# EAGLE design DAB+ FM Radio (EAGLE 7.6.0)
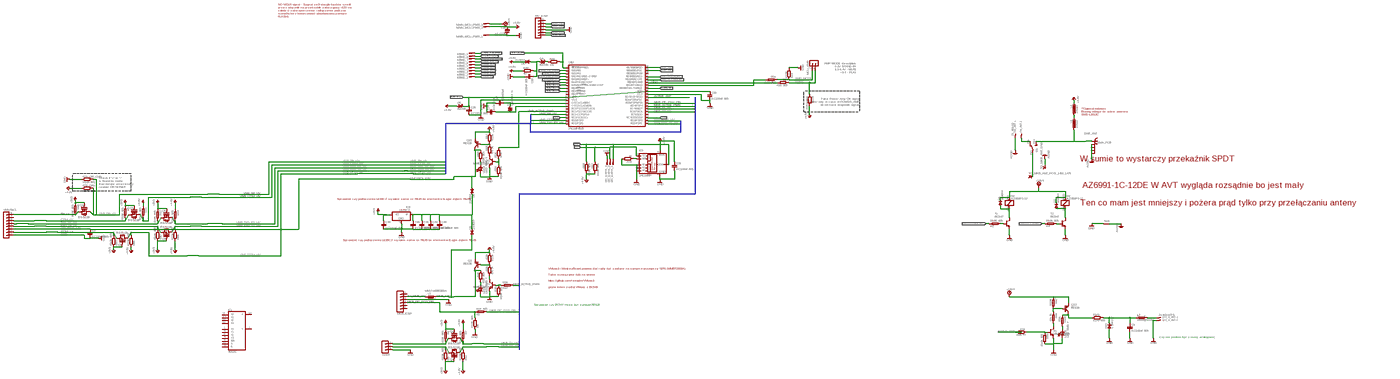
[diagram p0: schematic, sheet 1, overview]
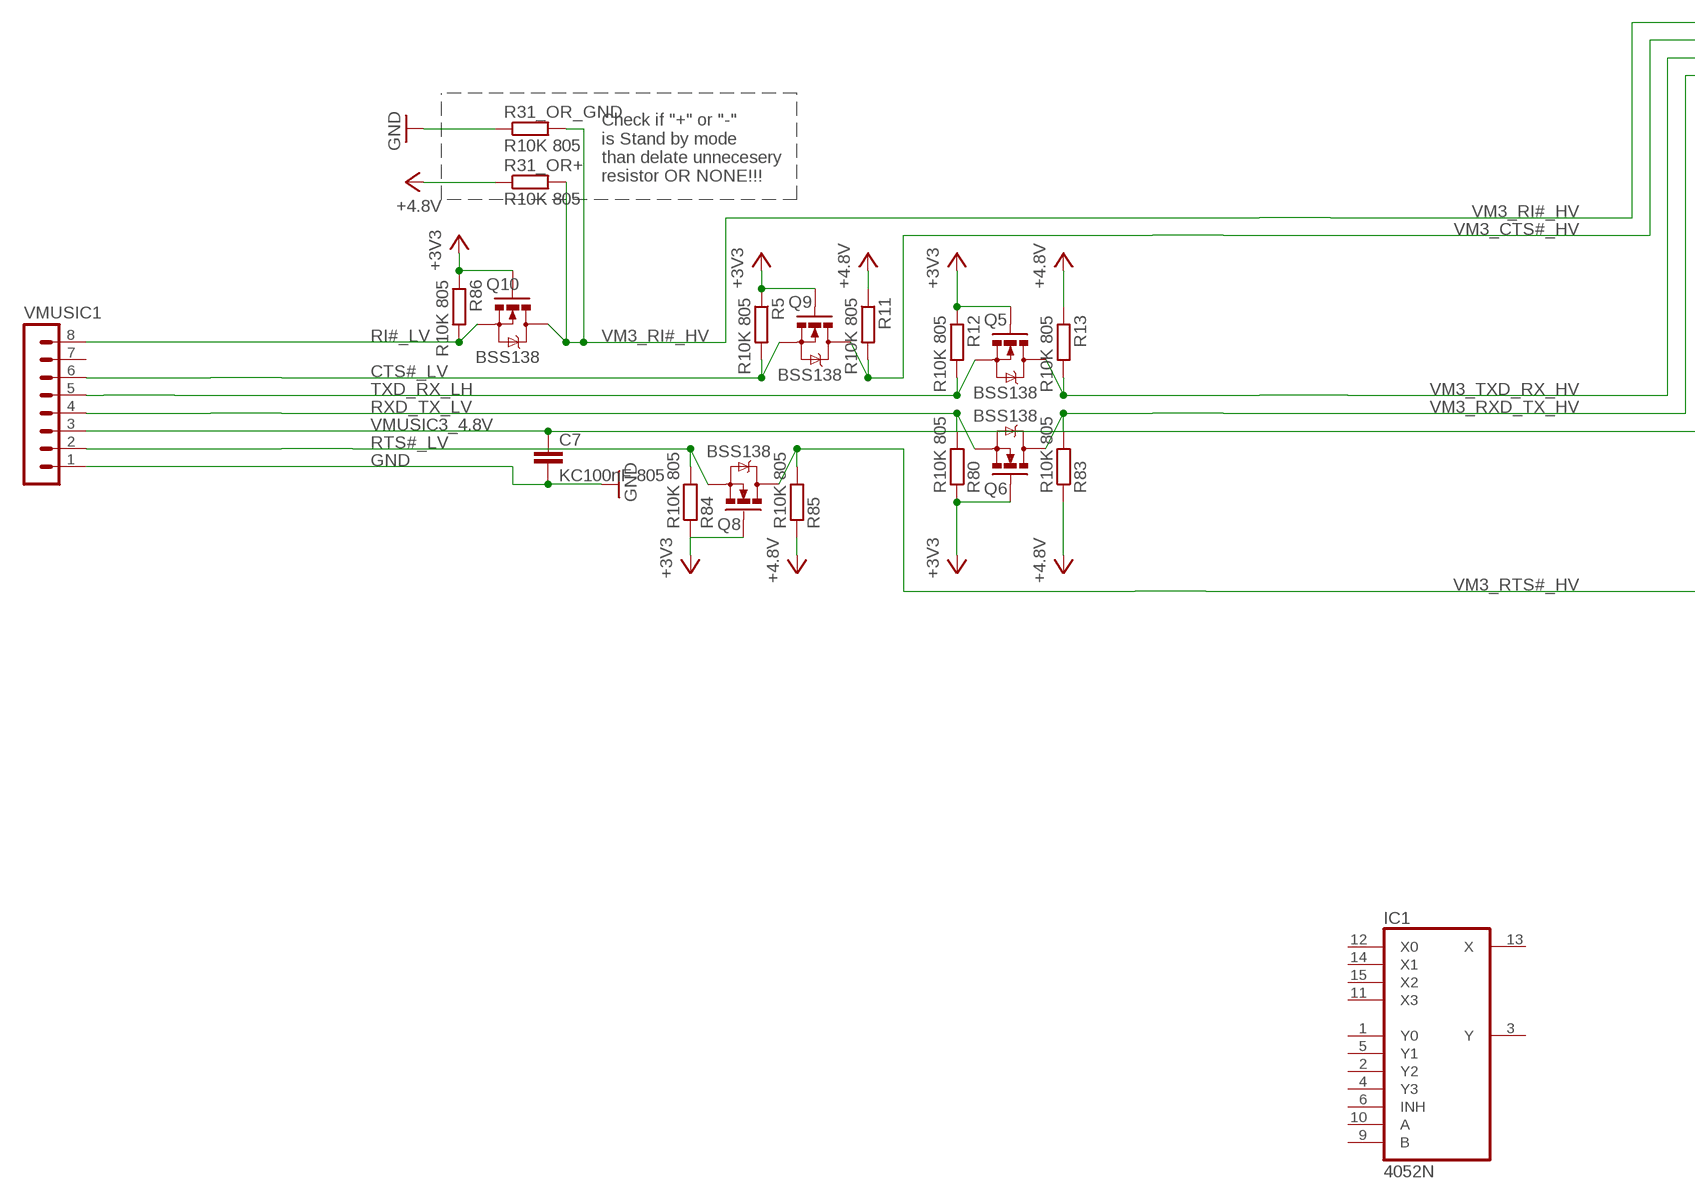
[diagram p1: schematic, sheet 1, part 1 of 4]
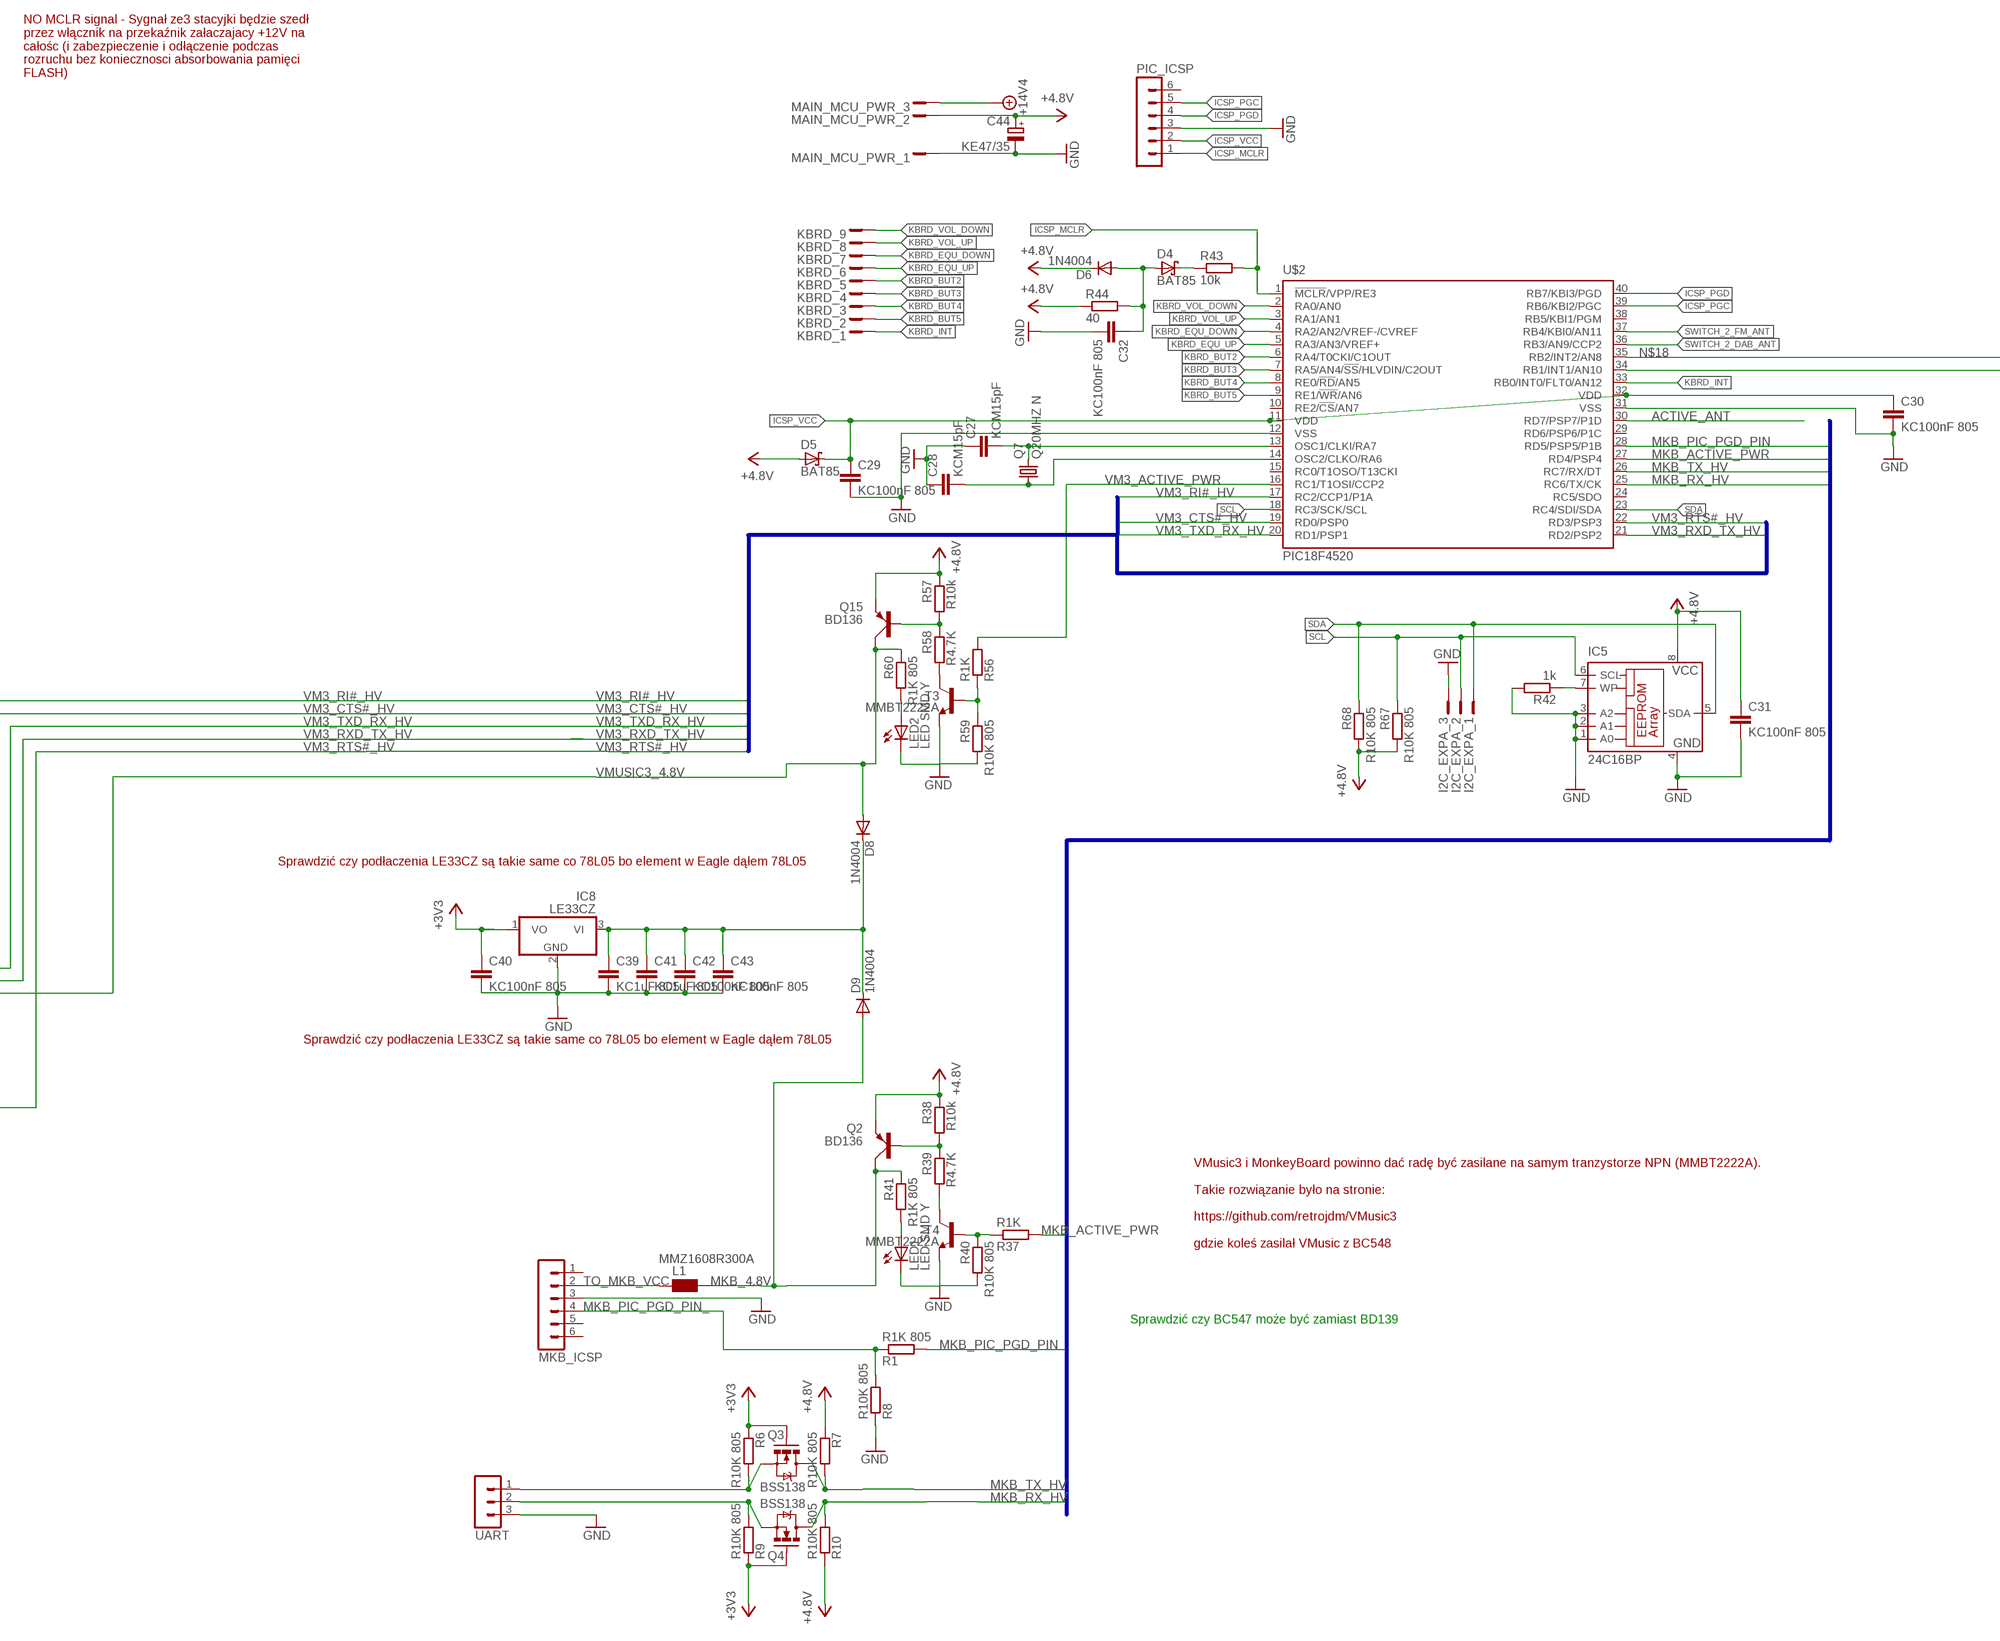
[diagram p2: schematic, sheet 1, part 2 of 4]
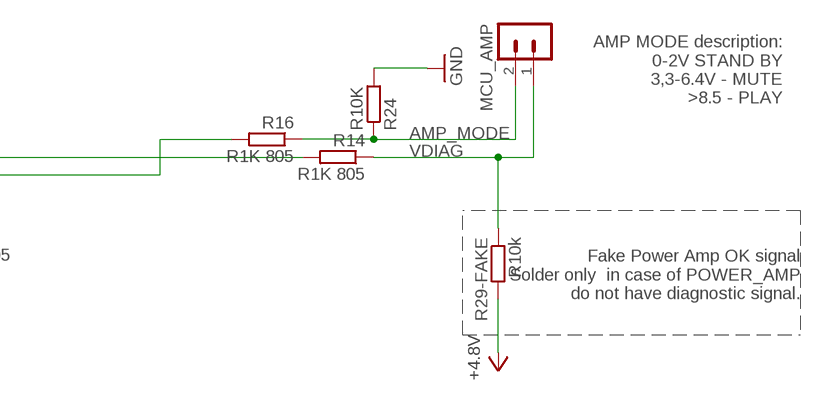
[diagram p3: schematic, sheet 1, part 3 of 4]
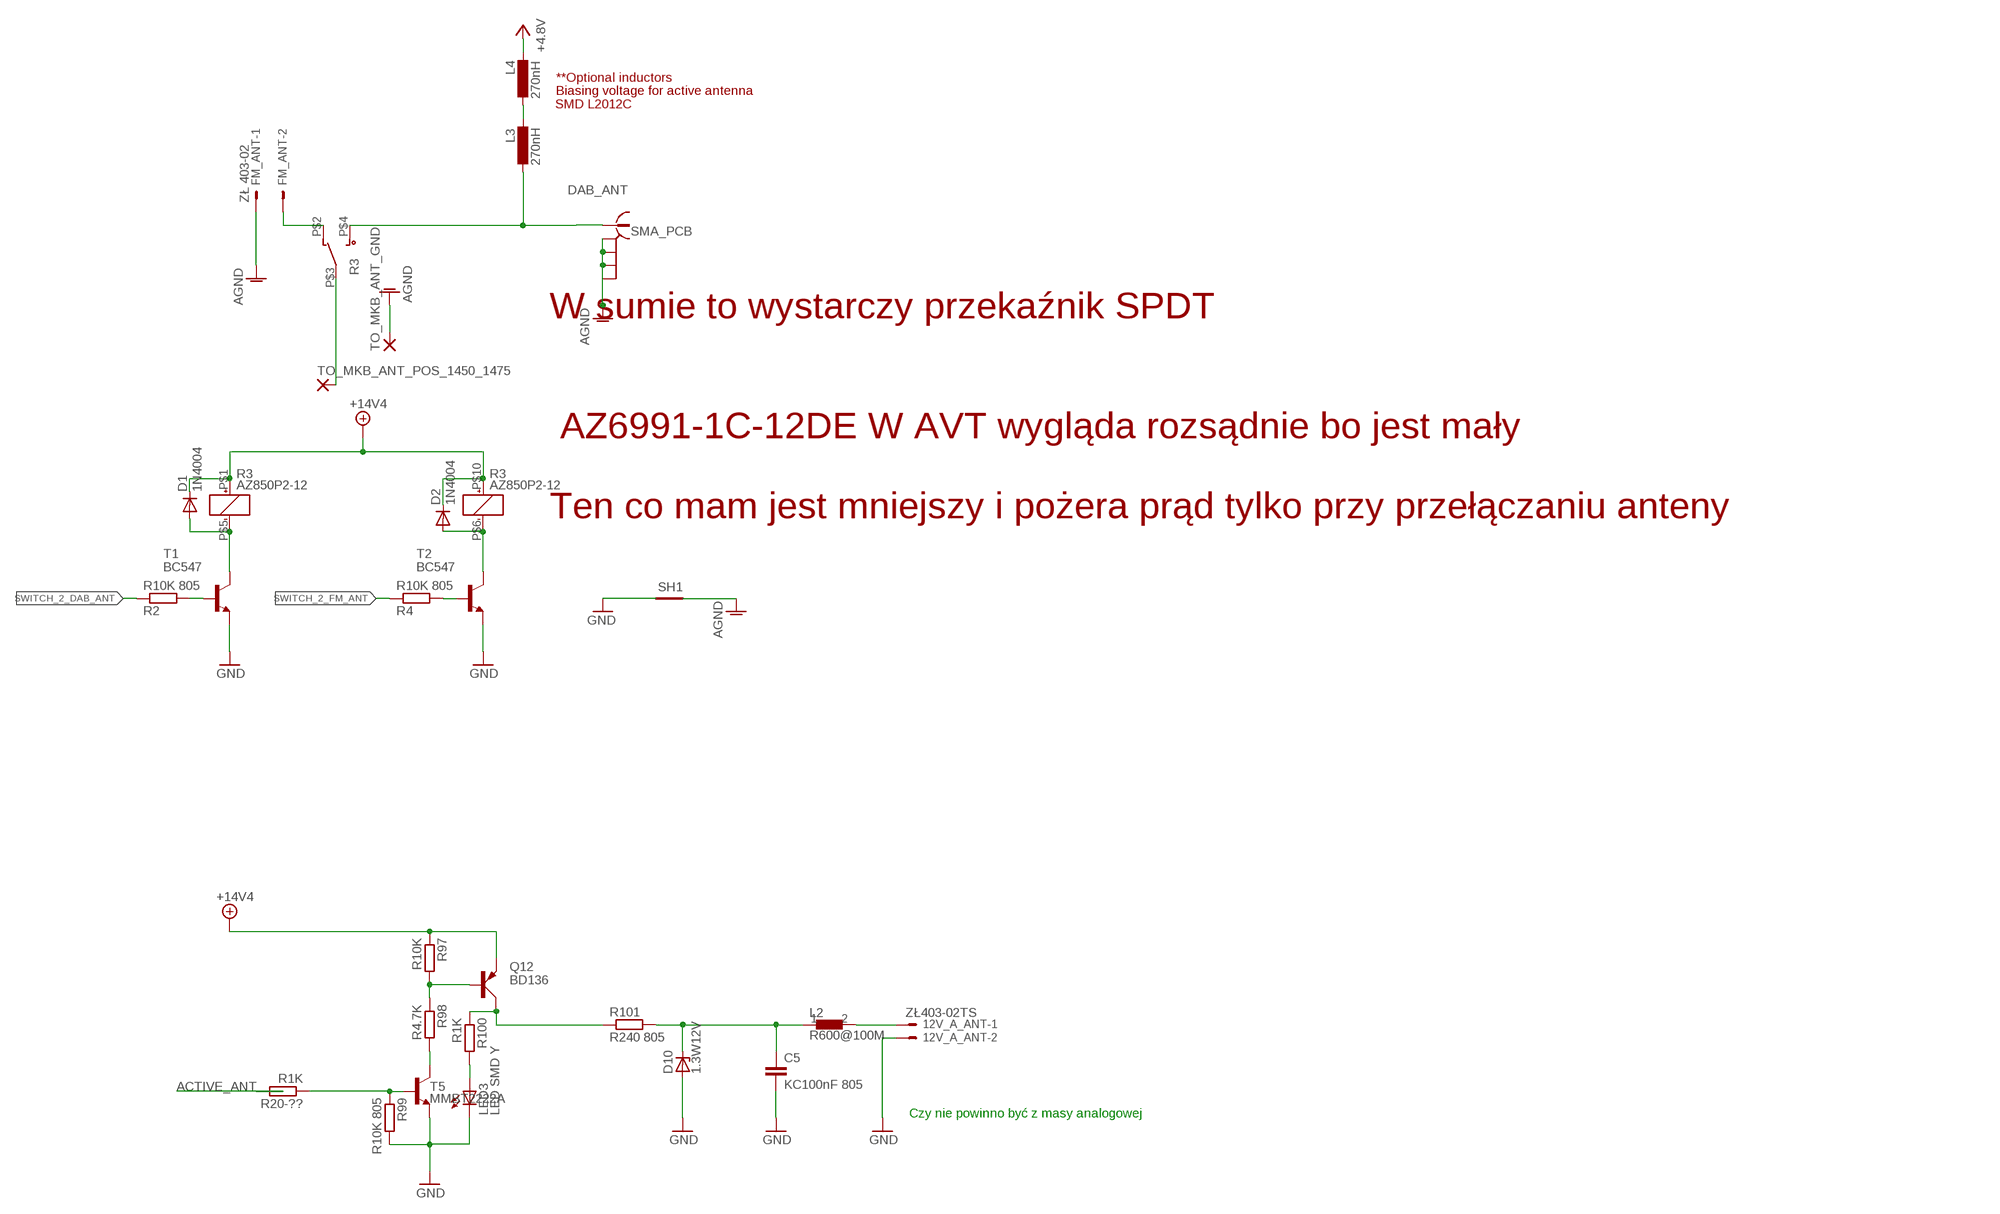
[diagram p4: schematic, sheet 1, part 4 of 4]

## Parts
12V_A_ANT  ZŁ403-02TS  22-23-2021  [22-23-2021]
C5  KC100nF 805  C-EUC0805  [C0805]
C7  KC100nF 805  C-EUC0805  [C0805]
C27  KCM15pF  C-EU025-024X044  [C025-024X044]
C28  KCM15pF  C-EU025-024X044  [C025-024X044]
C29  KC100nF 805  C-EUC0805  [C0805]
C30  KC100nF 805  C-EUC0805  [C0805]
C31  KC100nF 805  C-EUC0805  [C0805]
C32  KC100nF 805  C-EUC0805  [C0805]
C39  KC1uF 805  C-EU025-025X050  [C025-025X050]
C40  KC100nF 805  C-EU025-030X050  [C025-030X050]
C41  KC1uF 805  C-EU025-025X050  [C025-025X050]
C42  KC100nF 805  C-EU025-030X050  [C025-030X050]
C43  KC100nF 805  C-EU025-030X050  [C025-030X050]
C44  KE47/35  CPOL-EUTT2D6  [TT2D6]
D1  1N4004  1N4004DO41-7.6  [DO41-7.6]
D2  1N4004  1N4004DO41-7.6  [DO41-7.6]
D4  BAT85  BAT85DO34-V  [DO34-V]
D5  BAT85  BAT85DO34-V  [DO34-V]
D6  1N4004  1N4004DO41-7.6  [DO41-7.6]
D8  1N4004  1N4004DO41-V  [DO41-V]
D9  1N4004  1N4004DO41-V  [DO41-V]
D10  1.3W12V  ZENER-DIODEZD-2.5  [ZDIO-2.5]
DAB_ANT  SMA_PCB  [SMA_PCB]
FM_ANT  ZŁ 403-02  22-27-2021-02  [6410-02]
I2C_EXPA  JST_3_PIN_B3B-PH-KS  [B3B-PH-KS]
IC1  4052N  [DIL16]
IC5  24C16BP  [DIL8]
IC8  LE33CZ  78L05Z  [TO92]
KBRD  JST_9_PIN_B9B-PH-KS  [B9B-PH-KS]
L1  MMZ1608R300A  WE-CBF_0603  [0603]
L2  R600@100M  FERRITR0805  [R0805]
L3  270nH  L-EUL2012C  [L2012C]
L4  270nH  L-EUL2012C  [L2012C]
LED1  LED SMD Y  LEDCHIP-LED0805  [CHIP-LED0805]
LED2  LED SMD Y  LEDCHIP-LED0805  [CHIP-LED0805]
LED3  LED SMD Y  LEDCHIP-LED0805  [CHIP-LED0805]
MAIN_MCU_PWR  JST_3_PIN_B3B-XH-A  [B3B-XH-A]
MCU_AMP  MA02-1  [MA02-1]
MKB_ICSP  MA06-1  [MA06-1]
PIC_ICSP  MA06-1  [MA06-1]
Q2  BD136  BD140  [TO126AV]
Q3  BSS138  MOSFET-NCHANNELSMD  [SOT23-3]
Q4  BSS138  MOSFET-NCHANNELSMD  [SOT23-3]
Q5  BSS138  MOSFET-NCHANNELSMD  [SOT23-3]
Q6  BSS138  MOSFET-NCHANNELSMD  [SOT23-3]
Q7  Q20MHZ N  CRYSTALHC49S  [HC49/S]
Q8  BSS138  MOSFET-NCHANNELSMD  [SOT23-3]
Q9  BSS138  MOSFET-NCHANNELSMD  [SOT23-3]
Q10  BSS138  MOSFET-NCHANNELSMD  [SOT23-3]
Q12  BD136  BD140  [TO126AV]
Q15  BD136  BD140  [TO126AV]
R1  R1K 805  R-EU_R0805  [R0805]
R2  R10K 805  R-EU_R0805  [R0805]
R3  AZ850P2-12  [AZ850-2C]
R4  R10K 805  R-EU_R0805  [R0805]
R5  R10K 805  R-EU_R0805  [R0805]
R6  R10K 805  R-EU_R0805  [R0805]
R7  R10K 805  R-EU_R0805  [R0805]
R8  R10K 805  R-EU_R0805  [R0805]
R9  R10K 805  R-EU_R0805  [R0805]
R10  R10K 805  R-EU_R0805  [R0805]
R11  R10K 805  R-EU_R0805  [R0805]
R12  R10K 805  R-EU_R0805  [R0805]
R13  R10K 805  R-EU_R0805  [R0805]
R14  R1K 805  R-EU_R0805  [R0805]
R16  R1K 805  R-EU_R0805  [R0805]
R20-??  R1K  R-EU_R0805  [R0805]
R24  R10K  R-EU_R0805  [R0805]
R29-FAKE  R10k  R-EU_0204/7  [0204/7]
R31_OR+  R10K 805  R-EU_0204/5  [0204/5]
R31_OR_GND  R10K 805  R-EU_0204/5  [0204/5]
R37  R1K  R-EU_M0805  [M0805]
R38  R10k  R-EU_R0805  [R0805]
R39  R4.7K  R-EU_R0805  [R0805]
R40  R10K 805  R-EU_R0805  [R0805]
R41  R1K 805  R-EU_R0805  [R0805]
R42  1k  R-EU_0204/5  [0204/5]
R43  10k  R-EU_0204/5  [0204/5]
R44  40  R-EU_0204/5  [0204/5]
R56  R1K  R-EU_M0805  [M0805]
R57  R10k  R-EU_R0805  [R0805]
R58  R4.7K  R-EU_M0805  [M0805]
R59  R10K 805  R-EU_R0805  [R0805]
R60  R1K 805  R-EU_R0805  [R0805]
R67  R10K 805  R-EU_R0805  [R0805]
R68  R10K 805  R-EU_R0805  [R0805]
R80  R10K 805  R-EU_R0805  [R0805]
R83  R10K 805  R-EU_R0805  [R0805]
R84  R10K 805  R-EU_R0805  [R0805]
R85  R10K 805  R-EU_R0805  [R0805]
R86  R10K 805  R-EU_R0805  [R0805]
R97  R10K  R-EU_M0805  [M0805]
R98  R4.7K  R-EU_M0805  [M0805]
R99  R10K 805  R-EU_R0805  [R0805]
R100  R1K  R-EU_R0805  [R0805]
R101  R240 805  R-EU_M0805  [M0805]
SH1  SHORT-HT5  [SHORT_TOP-50]
T1  BC547  [TO92]
T2  BC547  [TO92]
T3  MMBT2222A  [SOT-23]
T4  MMBT2222A  [SOT-23]
T5  MMBT2222A  [SOT-23]
TO_MKB_ANT_GND  2,54/0,8  [2,54/0,8]
TO_MKB_ANT_POS_1450_1475  2,54/0,8  [2,54/0,8]
U$2  PIC18F4520  [DIL40]
UART  MA03-1  [MA03-1]
VMUSIC1  MA08-1  [MA08-1]

## Nets
+3V3: C40.1 IC8.1(VO) Q3.1(G) Q4.1(G) Q5.1(G) Q6.1(G) Q8.1(G) Q9.1(G) Q10.1(G) R5.1 R6.1 R9.1 R12.1 R80.1 R84.1 R86.1
+5V: C31.1 C44.+ D5.A D6.C IC5.8(VCC) L4.1 MAIN_MCU_PWR.P$2 Q2.E Q15.E R7.1 R10.1 R11.1 R13.1 R29-FAKE.2 R31_OR+.1 R38.1 R44.1 R57.1 R67.2 R68.2 R83.1 R85.1 ; supply symbol labelled +4.8V
+14V4: D1.C D2.C MAIN_MCU_PWR.P$3 Q12.E R3.P$1(S$1:+) R3.P$10(R$2:+) R97.1
ACTIVE_ANT: R20-??.2 U$2.30(RD7/PSP7/P1D)
AGND: DAB_ANT.GND@1(GND) DAB_ANT.GND@2(GND) DAB_ANT.GND@3(GND) DAB_ANT.GND@4(GND) FM_ANT.1 SH1.2 TO_MKB_ANT_GND.1(P)
AMP_MODE: MCU_AMP.2 R16.1 R24.1
CTS#_LV: Q9.2(S) R5.2 VMUSIC1.6
GND: 12V_A_ANT.2 C5.2 C7.2 C27.1 C28.1 C29.2 C30.2 C31.2 C32.2 C39.2 C40.2 C41.2 C42.2 C43.2 C44.- D10.A I2C_EXPA.P$3 IC5.1(A0) IC5.2(A1) IC5.3(A2) IC5.4(GND) IC8.2(GND) LED1.C LED2.C LED3.C MAIN_MCU_PWR.P$1 MKB_ICSP.3 PIC_ICSP.3 R8.1 R24.2 R31_OR_GND.1 R40.2 R42.2 R59.2 R99.2 SH1.1 T1.1(E) T2.1(E) T3.2(E) T4.2(E) T5.2(E) U$2.12(VSS) U$2.31(VSS) UART.3 VMUSIC1.1
ICSP_MCLR: PIC_ICSP.1 R43.2 U$2.1(!MCLR!/VPP/RE3)
ICSP_PGC: PIC_ICSP.5 U$2.39(RB6/KBI2/PGC)
ICSP_PGD: PIC_ICSP.4 U$2.40(RB7/KBI3/PGD)
ICSP_VCC: C29.1 C30.1 D5.C PIC_ICSP.2 U$2.11(VDD) U$2.32(VDD)
KBRD_BUT2: KBRD.P$5 U$2.6(RA4/T0CKI/C1OUT)
KBRD_BUT3: KBRD.P$4 U$2.7(RA5/AN4/!SS!/HLVDIN/C2OUT)
KBRD_BUT4: KBRD.P$3 U$2.8(RE0/!RD!/AN5)
KBRD_BUT5: KBRD.P$2 U$2.9(RE1/!WR!/AN6)
KBRD_EQU_DOWN: KBRD.P$7 U$2.4(RA2/AN2/VREF-/CVREF)
KBRD_EQU_UP: KBRD.P$6 U$2.5(RA3/AN3/VREF+)
KBRD_INT: KBRD.P$1 U$2.33(RB0/INT0/FLT0/AN12)
KBRD_VOL_DOWN: KBRD.P$9 U$2.2(RA0/AN0)
KBRD_VOL_UP: KBRD.P$8 U$2.3(RA1/AN1)
MKB_4.8V: D9.A L1.2 Q2.C R41.1
MKB_ACTIVE_PWR: R37.2 U$2.27(RD4/PSP4)
MKB_PIC_PGD_PIN: R1.2 U$2.28(RD5/PSP5/P1B)
MKB_PIC_PGD_PIN_: MKB_ICSP.4 R1.1 R8.2
MKB_RX_HV: Q4.3(D) R10.2 U$2.25(RC6/TX/CK)
MKB_TX_HV: Q3.3(D) R7.2 U$2.26(RC7/RX/DT)
N$1: R2.2 T1.2(B)
N$2: D1.A R3.P$5(S$1:-) T1.3(C)
N$3: R3.P$3 TO_MKB_ANT_POS_1450_1475.1(P)
N$4: DAB_ANT.P$1 L3.2 R3.P$4
N$5: FM_ANT.2 R3.P$2
N$6: D2.A R3.P$6(R$2:-) T2.3(C)
N$7: R4.2 T2.2(B)
N$8: R16.2 U$2.34(RB1/INT1/AN10)
N$9: Q3.2(S) R6.2 UART.1
N$10: Q4.2(S) R9.2 UART.2
N$12: L3.1 L4.2
N$15: C27.2 Q7.2 U$2.13(OSC1/CLKI/RA7)
N$16: C28.2 Q7.1 U$2.14(OSC2/CLKO/RA6)
N$18: R14.2 U$2.35(RB2/INT2/AN8)
N$27: R56.1 R59.1 T3.1(B)
N$28: R58.2 T3.3(C)
N$29: Q15.B R57.2 R58.1
N$31: LED2.A R60.2
N$36: R37.1 R40.1 T4.1(B)
N$37: R39.2 T4.3(C)
N$38: Q2.B R38.2 R39.1
N$39: LED1.A R41.2
N$40: IC5.7(WP) R42.1
N$41: D4.C R43.1
N$42: C32.1 D4.A D6.A R44.2
N$68: C39.1 C41.1 C42.1 C43.1 D8.C D9.C IC8.3(VI)
N$84: R20-??.1 R99.1 T5.1(B)
N$85: R98.2 T5.3(C)
N$86: Q12.B R97.2 R98.1
N$87: Q12.C R100.1 R101.1
N$88: LED3.A R100.2
N$91: C5.1 D10.C L2.1 R101.2
N$92: 12V_A_ANT.1 L2.2
RI#_LV: Q10.2(S) R86.2 VMUSIC1.8
RTS#_LV: Q8.2(S) R84.2 VMUSIC1.2
RXD_TX_LV: Q6.2(S) R80.2 VMUSIC1.4
SCL: I2C_EXPA.P$2 IC5.6(SCL) R67.1 U$2.18(RC3/SCK/SCL)
SDA: I2C_EXPA.P$1 IC5.5(SDA) R68.1 U$2.23(RC4/SDI/SDA)
SWITCH_2_DAB_ANT: R2.1 U$2.36(RB3/AN9/CCP2)
SWITCH_2_FM_ANT: R4.1 U$2.37(RB4/KBI0/AN11)
TO_MKB_VCC: L1.1 MKB_ICSP.2
TXD_RX_LH: Q5.2(S) R12.2 VMUSIC1.5
VDIAG: MCU_AMP.1 R14.1 R29-FAKE.1
VM3_ACTIVE_PWR: R56.2 U$2.16(RC1/T1OSI/CCP2)
VM3_CTS#_HV: Q9.3(D) R11.2 U$2.19(RD0/PSP0)
VM3_RI#_HV: Q10.3(D) R31_OR+.2 R31_OR_GND.2 U$2.17(RC2/CCP1/P1A)
VM3_RTS#_HV: Q8.3(D) R85.2 U$2.22(RD3/PSP3)
VM3_RXD_TX_HV: Q6.3(D) R83.2 U$2.21(RD2/PSP2)
VM3_TXD_RX_HV: Q5.3(D) R13.2 U$2.20(RD1/PSP1)
VMUSIC3_4.8V: C7.1 D8.A Q15.C R60.1 VMUSIC1.3
Unconnected: IC1.1(Y0) IC1.2(Y2) IC1.3(Y) IC1.4(Y3) IC1.5(Y1) IC1.6(INH) IC1.9(B) IC1.10(A) IC1.11(X3) IC1.12(X0) IC1.13(X) IC1.14(X1) IC1.15(X2) MKB_ICSP.1 MKB_ICSP.5 MKB_ICSP.6 PIC_ICSP.6 R3.P$7 R3.P$8 R3.P$9 U$2.10(RE2/!CS!/AN7) U$2.15(RC0/T1OSO/T13CKI) U$2.24(RC5/SDO) U$2.29(RD6/PSP6/P1C) U$2.38(RB5/KBI1/PGM) VMUSIC1.7

## Buses
MKB_I/O,MKB_!SHNT!,MKB_!SHDN!,MKB_!RESET!,MKB_TX_HV,MKB_RX_HV,MKB_ACTIVE_PWR,MKB_PIC_PGD_PIN
VM3_RI#_HV,VM3_CTS#_HV,VM3_TXD_RX_HV,VM3_RXD_TX_HV,VM3_RTS#_HV

## Notes on the sheet
- NO MCLR signal - Sygnał ze3 stacyjki będzie szedł
  przez włącznik na przekaźnik załaczajacy +12V na
  całośc (i zabezpieczenie i odłączenie podczas
  rozruchu bez koniecznosci absorbowania pamięci
  FLASH)
- AMP MODE description:
  0-2V STAND BY
  3,3-6.4V - MUTE
  >8.5 - PLAY
- Fake Power Amp OK signal
  Solder only  in case of POWER_AMP
  do not have diagnostic signal.
- **Optional inductors
- Biasing voltage for active antenna
- SMD L2012C
- Check if "+" or "-"
  is Stand by mode 
  than delate unnecesery
  resistor OR NONE!!!
- Sprawdzić czy podłaczenia LE33CZ są takie same co 78L05 bo element w Eagle dąłem 78L05
- W sumie to wystarczy przekaźnik SPDT
  
  
   AZ6991-1C-12DE W AVT wygląda rozsądnie bo jest mały
  
  Ten co mam jest mniejszy i pożera prąd tylko przy przełączaniu anteny
- Sprawdzić czy podłaczenia LE33CZ są takie same co 78L05 bo element w Eagle dąłem 78L05
- VMusic3 i MonkeyBoard powinno dać radę być zasilane na samym tranzystorze NPN (MMBT2222A).
  
  Takie rozwiązanie było na stronie:
  
  https://github.com/retrojdm/VMusic3
  
  gdzie koleś zasilał VMusic z BC548
- Sprawdzić czy BC547 może być zamiast BD139
- Czy nie powinno być z masy analogowej

## Power pins joined to a net without a drawn wire
GND: IC1.8(GND)
VCC: IC1.16(VCC)
VEE: IC1.7(VEE)

## Library data of the parts
12V_A_ANT = con-molex:22-23-2021: .100" (2.54mm) Center Header - 2 Pin; MF: MOLEX; MPN: 22-23-2021; OC_FARNELL: 1462926; OC_NEWARK: 25C3832
C5 C7 C27-C32 C39-C43 = rcl:C-EU: CAPACITOR, European symbol
C44 = rcl:CPOL-EU: POLARIZED CAPACITOR, European symbol
D1 D2 D6 D8 D9 = diode_SileliS:1N4004: DIODE general purpose rectifier, 1 A
D4 D5 = diode_SileliS:BAT85
D10 = diode:ZENER-DIODE: Z-Diode
DAB_ANT = Monkey:SMA_PCB: TE CONNECTIVITY - 5-1814832-1 - SOCKET, SMA, STRAIGHT PCB,50OHM Manufacturer: TE CONNECTIVITY Order Code: 1248990 Manufacturer Part No: 5-1814832-1 http://www.farnell.com/datasheets/316178.pdf
FM_ANT = con-molex:22-?-02: CONNECTOR wire to board 2.54 mm (.1 inch) pitch header; OC_FARNELL: unknown; OC_NEWARK: unknown
I2C_EXPA MAIN_MCU_PWR = conn-JST:JST_3_PIN_
IC1 = 40xx:4052: Dual 4-channel ANALOG MULTIPLEXER
IC5 = microchip:24*: Serial EEPROM I2C; MPN: AT24C16B-PU; OC_FARNELL: 1362650; OC_NEWARK: 50M3323
IC8 = linear:78*: Positive VOLTAGE REGULATOR Source: http://cache.national.com/ds/LM/LM78L05.pdf http://www.fairchildsemi.com/ds/LM/LM7805.pdf
KBRD = conn-JST:JST_9_PIN_
L1 = wuerth-elektronik:WE-CBF: SMD EMI Suppression Ferrite Beads - excellent anti-EMI properties - low DCR - impedances till 3000 ohms - rated current up to 6 A
L2 = ferrit_bear:FERRIT
L3 L4 = resistor:L-EU: INDUCTOR, European symbol
LED1-LED3 = adafruit:LED: LED OSRAM: - CHIPLED LG R971, LG N971, LY N971, LG Q971, LY Q971, LO R971, LY R971 LH N974, LH R974 LS Q976, LO Q976, LY Q976 LO Q996 - Hyper CHIPLED LW Q18S LB Q993, LB Q99A, LB R99A - SideLED LS A670, LO A670, LY A670, LG A670, LP A670 LB A673, LV A673, LT A673, LW A673 LH A674 LY A675 LS A676, LA A676, LO A676, LY A676, LW A676 LS A679, LY A679, LG A679 - Hyper Micro SIDELED® LS Y876, LA Y876, LO Y876, LY Y876 LT Y87S - SmartLED LW L88C, LW L88S LB L89C, LB L89S, LG L890 LS L89K, LO L89K, LY L89K LS L896, LA L896, LO L896, LY L896 - TOPLED LS T670, LO T670, LY T670, LG T670, LP T670 LSG T670, LSP T670, LSY T670, LOP T670, LYG T670 LG T671, LOG T671, LSG T671 LB T673, LV T673, LT T673, LW T673 LH T674 LS T676, LA T676, LO T676, LY T676, LB T676, LH T676, LSB T676, LW T676 LB T67C, LV T67C, LT T67C, LS T67K, LO T67K, LY T67K, LW E67C LS E67B, LA E67B, LO E67B, LY E67B, LB E67C, LV E67C, LT E67C LW T67C LS T679, LY T679, LG T679 LS T770, LO T770, LY T770, LG T770, LP T770 LB T773, LV T773, LT T773, LW T773 LH T774 LS E675, LA E675, LY E675, LS T675 LS T776, LA T776, LO T776, LY T776, LB T776 LHGB T686 LT T68C, LB T68C - Hyper Mini TOPLED® LB M676 - Mini TOPLED Santana® LG M470 LS M47K, LO M47K, LY M47K Source: http://www.osram.convergy.de/
MCU_AMP = con-lstb_SileliS:MA02-1: PIN HEADER
MKB_ICSP PIC_ICSP = con-lstb:MA06-1: PIN HEADER; OC_FARNELL: unknown; OC_NEWARK: unknown
Q2 Q12 Q15 = transistor-power:BD140: PNP TRANSISTOR
Q3-Q6 Q8-Q10 = SparkFun:MOSFET-NCHANNEL
Q7 = adafruit:CRYSTAL: CRYSTAL; OC_FARNELL: 1667008; OC_NEWARK: unknown
R1 R2 R4-R14 R16 R20-?? R24 R29-FAKE R31_OR+ R31_OR_GND R37-R44 R56-R60 R67 R68 R80 R83-R86 R97-R101 = rcl:R-EU_: RESISTOR, European symbol
R3 = relay_silelis:AZ850P2-12
SH1 = shorts-old:SHORT-H: Short between two nets; BOM: no
T1 T2 = transistor:BC547: NPN TRANSISTOR
T3-T5 = MMBT2222A_PMBT2907A:MMBT2222A
TO_MKB_ANT_GND TO_MKB_ANT_POS_1450_1475 = wirepad:2,54/0,8: THROUGH-HOLE PAD
U$2 = microchip_SileliS:PIC18F4*20
UART = con-lstb:MA03-1: PIN HEADER; OC_FARNELL: unknown; OC_NEWARK: unknown
VMUSIC1 = con-lstb_SileliS:MA08-1: PIN HEADER; OC_FARNELL: unknown; OC_NEWARK: unknown

## Board
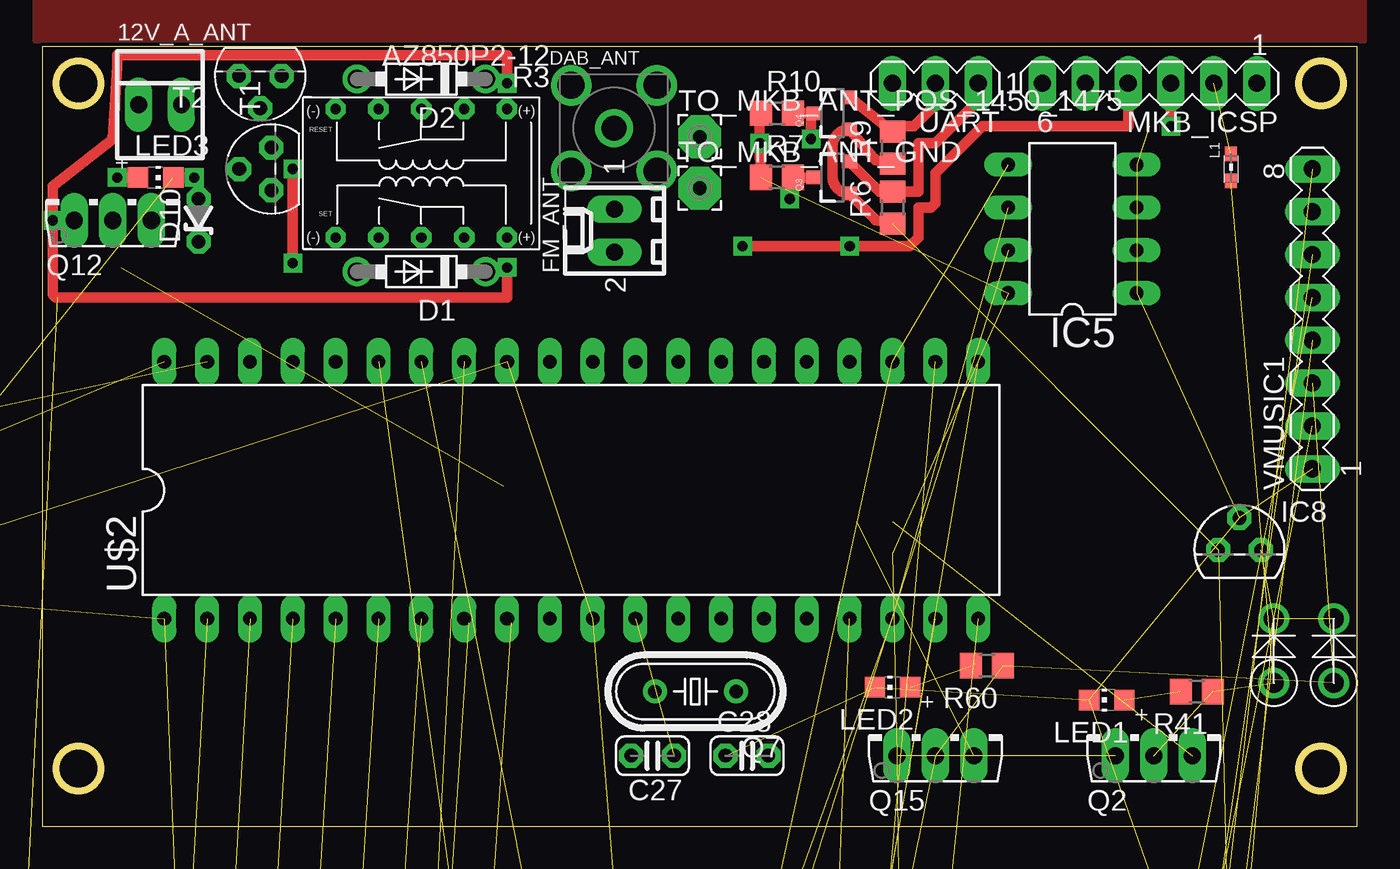
[diagram p5: board, top side]
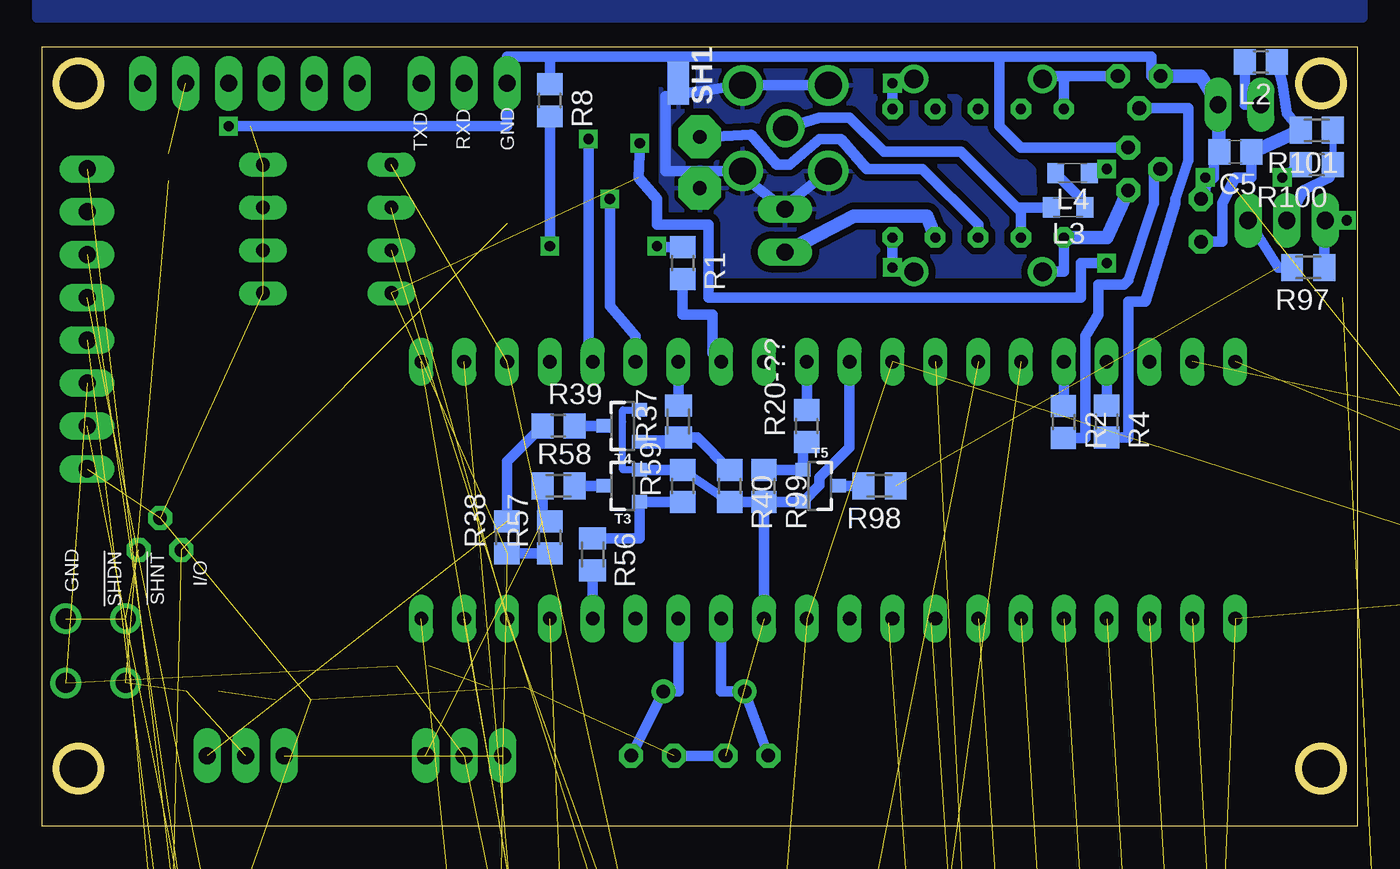
[diagram p6: board, bottom side, seen from below]

Size 77.98 x 46.23 mm. Coordinates in mm from the lower left corner, seen from the top.
Outline: 0,46.23 0,0 77.98,0 77.98,46.23 0,46.23
Outline: circle at 2.16,44.07 radius 1.32
Outline: circle at 2.16,3.43 radius 1.32
Outline: circle at 75.82,3.43 radius 1.32
Outline: circle at 75.82,44.07 radius 1.32
Copper layers (1*16): Top 0.035mm / dielectric 1.5mm / Bottom 0.035mm
Design rules "SparkFun": minimum track width 8mil, minimum drill 20mil, track to track 8mil, track to pad 8mil, pad to pad 8mil, via to via 8mil, smd to smd 8mil, copper to edge 10mil, drill to drill 8mil, minimum pad ring 12mil, minimum via ring 10mil, stop-mask expansion 4mil, vias tented up to drill 25mil, thermal gap 10mil

### Footprints (pad centres in the part's own frame; a part is rotated, then mirrored left to right if it is on the bottom)
22-23-2021 = drill 1 long: 1 -1.27,0; 2 1.27,0
C0805 = smd 1.3 x 1.5: 1 -0.95,0; 2 0.95,0
C025-024X044 = drill 0.813 octagon: 1 -1.27,0; 2 1.27,0
C025-025X050 = drill 0.813 octagon: 1 -1.27,0; 2 1.27,0
C025-030X050 = drill 0.813 octagon: 1 -1.27,0; 2 1.27,0
TT2D6 = drill 0.813: + -1.27,0 | drill 0.813 octagon: - 1.27,0
DO41-7.6 = drill 1.1 pad 1.7: A 3.81,0; C -3.81,0
DO34-V = drill 0.9: A 3.81,0; C 0,0
DO41-V = drill 1.2: A 2.54,0; C -1.27,0
ZDIO-2.5 = drill 0.813 octagon: A 1.27,0; C -1.27,0
SMA_PCB = drill 1.6: GND@1 -2.54,2.54; GND@2 2.54,2.54; GND@3 -2.54,-2.54; GND@4 2.54,-2.54 | drill 1.5: P$1 0,0
6410-02 = drill 1.016 long: 1 1.27,0; 2 -1.27,0
B3B-PH-KS = drill 0.75 pad 1.2 square: P$1 -2,1.7; P$2 -4,1.7; P$3 -6,1.7
DIL16 = drill 0.813 long: 1 -8.89,-3.81; 2 -6.35,-3.81; 3 -3.81,-3.81; 4 -1.27,-3.81; 5 1.27,-3.81; 6 3.81,-3.81; 7 6.35,-3.81; 8 8.89,-3.81; 9 8.89,3.81; 10 6.35,3.81; 11 3.81,3.81; 12 1.27,3.81; 13 -1.27,3.81; 14 -3.81,3.81; 15 -6.35,3.81; 16 -8.89,3.81
DIL8 = drill 0.813 long: 1 -3.81,-3.81; 2 -1.27,-3.81; 3 1.27,-3.81; 4 3.81,-3.81; 5 3.81,3.81; 6 1.27,3.81; 7 -1.27,3.81; 8 -3.81,3.81
TO92 = drill 0.813 octagon: 1 -1.27,0; 2 0,1.905; 3 1.27,0
B9B-PH-KS = drill 0.75 pad 1.2 square: P$1 -2,1.7; P$2 -4,1.7; P$3 -6,1.7; P$4 -8,1.7; P$5 -10,1.7; P$6 -12,1.7; P$7 -14,1.7; P$8 -16,1.7; P$9 -18,1.7
0603 = smd 0.85 x 0.7: 1 -0.9,0; 2 0.7,0
R0805 = smd 1.3 x 1.5: 1 -0.95,0; 2 0.95,0
L2012C = smd 1 x 1.2: 1 -1,0; 2 1,0
CHIP-LED0805 = smd 1.2 x 1.2: A 0,-1.05; C 0,1.05
B3B-XH-A = drill 0.8 long: P$1 -2.45,2.35; P$2 -4.95,2.35; P$3 -7.45,2.35
MA02-1 = drill 1.016 long: 1 -2.54,0; 2 0,0
MA06-1 = drill 1.016 long: 1 -6.35,0; 2 -3.81,0; 3 -1.27,0; 4 1.27,0; 5 3.81,0; 6 6.35,0
TO126AV = drill 1.016 long: B 2.286,-1.27; C 0,-1.27; E -2.286,-1.27
SOT23-3 = smd 0.8 x 0.9: 1 -0.95,-1; 2 0.95,-1; 3 0,1.1
HC49/S = drill 0.813: 1 -2.413,0; 2 2.413,0
AZ850-2C = drill 0.6 octagon: P$1 -5.08,3.81; P$2 -2.54,3.81; P$3 0,3.81; P$4 2.54,3.81; P$5 5.08,3.81; P$6 5.08,-3.81; P$7 2.54,-3.81; P$8 0,-3.81; P$9 -2.54,-3.81; P$10 -5.08,-3.81
0204/7 = drill 0.813 octagon: 1 -3.81,0; 2 3.81,0
0204/5 = drill 0.813 octagon: 1 -2.54,0; 2 2.54,0
M0805 = smd 1.3 x 1.6: 1 -0.95,0; 2 0.95,0
SHORT_TOP-50 = smd 1.27 x 1.27: 1 0.635,0; 2 -0.635,0
TO92' = drill 0.813 octagon: 1 1.27,0; 2 0,1.905; 3 -1.27,0
SOT-23 = smd 0.8 x 0.9: 1 -0.95,-1; 2 0.95,-1; 3 0,1.1
2,54/0,8 = drill 0.813 pad 2.54 octagon: 1 0,0
DIL40 = drill 0.813 long: 1 -24.13,-7.62; 2 -21.59,-7.62; 3 -19.05,-7.62; 4 -16.51,-7.62; 5 -13.97,-7.62; 6 -11.43,-7.62; 7 -8.89,-7.62; 8 -6.35,-7.62; 9 -3.81,-7.62; 10 -1.27,-7.62; 11 1.27,-7.62; 12 3.81,-7.62; 13 6.35,-7.62; 14 8.89,-7.62; 15 11.43,-7.62; 16 13.97,-7.62; 17 16.51,-7.62; 18 19.05,-7.62; 19 21.59,-7.62; 20 24.13,-7.62; 21 24.13,7.62; 22 21.59,7.62; 23 19.05,7.62; 24 16.51,7.62; 25 13.97,7.62; 26 11.43,7.62; 27 8.89,7.62; 28 6.35,7.62; 29 3.81,7.62; 30 1.27,7.62; 31 -1.27,7.62; 32 -3.81,7.62; 33 -6.35,7.62; 34 -8.89,7.62; 35 -11.43,7.62; 36 -13.97,7.62; 37 -16.51,7.62; 38 -19.05,7.62; 39 -21.59,7.62; 40 -24.13,7.62
MA03-1 = drill 1.016 long: 1 -2.54,0; 2 0,0; 3 2.54,0
MA08-1 = drill 1.016 long: 1 -8.89,0; 2 -6.35,0; 3 -3.81,0; 4 -1.27,0; 5 1.27,0; 6 3.81,0; 7 6.35,0; 8 8.89,0

### Placement (x,y rotation side)
12V_A_ANT  6.98,42.8 0 top
C5  7.24,40.01 180 bottom
C7  not placed on the board
C27  36.2,4.19 180 top
C28  41.78,4.19 0 top
C29  not placed on the board
C30  not placed on the board
C31  not placed on the board
C32  not placed on the board
C39  not placed on the board
C40  not placed on the board
C41  not placed on the board
C42  not placed on the board
C43  not placed on the board
C44  not placed on the board
D1  22.48,32.89 180 top
D2  22.48,44.32 180 top
D4  not placed on the board
D5  not placed on the board
D6  not placed on the board
D8  76.58,11.05 270 top
D9  73.03,11.05 270 top
D10  9.27,35.94 90 top
DAB_ANT  33.91,41.4 90 top
FM_ANT  33.93,35.33 90 top
I2C_EXPA  not placed on the board
IC1  not placed on the board
IC5  61.09,35.43 90 top
IC8  70.99,16.38 0 top
KBRD  not placed on the board
L1  70.48,38.99 270 top
L2  5.71,45.34 180 bottom
L3  17.14,36.7 180 bottom
L4  16.89,38.73 180 bottom
LED1  63.12,7.49 90 top
LED2  50.42,8.25 90 top
LED3  6.73,38.48 270 top
MAIN_MCU_PWR  not placed on the board
MCU_AMP  not placed on the board
MKB_ICSP  65.66,44.07 180 top
PIC_ICSP  not placed on the board
Q2  65.91,5.46 0 top
Q3  46.86,38.48 90 top
Q4  46.86,42.29 90 top
Q5  not placed on the board
Q6  not placed on the board
Q7  38.73,8 180 top
Q8  not placed on the board
Q9  not placed on the board
Q10  not placed on the board
Q12  4.19,37.21 0 top
Q15  52.96,5.46 0 top
R1  40,33.4 270 bottom
R2  17.42,23.98 270 bottom
R3  22.48,38.73 180 top
R4  14.86,24 270 bottom
R5  not placed on the board
R6  50.42,36.7 90 top
R7  43.56,38.48 0 top
R8  47.88,43.05 270 bottom
R9  50.42,40.26 90 top
R10  43.56,42.29 0 top
R11  not placed on the board
R12  not placed on the board
R13  not placed on the board
R14  not placed on the board
R16  not placed on the board
R20-??  32.64,23.75 90 bottom
R24  not placed on the board
R29-FAKE  not placed on the board
R31_OR+  not placed on the board
R31_OR_GND  not placed on the board
R37  40.26,24 90 bottom
R38  50.42,17.14 90 bottom
R39  47.37,23.75 0 bottom
R40  37.21,20.19 270 bottom
R41  68.45,8 180 top
R42  not placed on the board
R43  not placed on the board
R44  not placed on the board
R56  45.34,16.13 270 bottom
R57  47.88,17.14 90 bottom
R58  47.37,20.19 0 bottom
R59  40,20.19 90 bottom
R60  56.01,9.53 180 top
R67  not placed on the board
R68  not placed on the board
R80  not placed on the board
R83  not placed on the board
R84  not placed on the board
R85  not placed on the board
R86  not placed on the board
R97  2.92,33.15 180 bottom
R98  28.32,20.19 180 bottom
R99  35.18,20.19 270 bottom
R100  2.41,39.24 180 bottom
R101  2.41,41.27 180 bottom
SH1  40.26,44.07 90 bottom
T1  BC547  [TO92']  13.59,38.99 90 top
T2  BC547  [TO92']  12.93,44.5 180 top
T3  43.56,20.19 90 bottom
T4  43.56,23.75 90 bottom
T5  31.88,20.19 270 bottom
TO_MKB_ANT_GND  38.99,37.85 0 top
TO_MKB_ANT_POS_1450_1475  38.99,40.89 0 top
U$2  31.37,19.94 0 top
UART  52.96,44.07 180 top
VMUSIC1  75.31,30.1 90 top

### Tracks (layer width: path | path; a pad name or v marks a point on that pad's centre or on a via)
+3V3  (12 unrouted)
  Top 0.61: R9.1 49.4,39.5 Q4.1 arc90 46.86,40.34 46.86,39.5 46.86,38.53 arc90 Q3.1 49.4,35.99 49.4,35.94 R6.1
+5V  (via drill 0.6)  (18 unrouted)
  Top 0.61: v14.86,38.99 v14.86,33.4 | R7.1 v42.55,40.51 42.55,42.23 R10.1
  Bottom 0.61: R57.1 R38.1 | L4.1 v14.86,38.99 | v14.86,33.4 16.38,33.4 16.38,31.37 38.48,31.37 38.48,35.69 41.53,35.69 41.53,37.21 R7.1 v42.55,40.51
+14V4  (via drill 0.6)  (1 unrouted)
  Top 0.61: v27.56,44.07 27.56,45.72 4.45,45.72 4.45,45.09 4.19,40.77 0.63,37.97 v0.63,35.94 0.63,31.62 arc90 0.89,31.37 24.77,31.37 27.56,31.37 v27.56,33.15
  Bottom 0.61: R97.1 1.97,35.62 Q12.E v0.63,35.94 | R3.P$10 v27.56,44.07 26.29,44.07 D2.C | R3.P$1 27.56,33.91 | 27.56,33.91 v27.56,33.15 | D1.C 27.56,32.89 27.56,33.91
ACTIVE_ANT
  Bottom 0.61: U$2.30 R20-??.2
AGND
  Bottom 0.406: 38.99,38.35 38.99,38.86
  Bottom 0.61: DAB_ANT.GND@2 DAB_ANT.GND@4 SH1.2 40.26,43.31 41.02,43.31 41.02,40.01 41.02,38.86 38.99,38.86 DAB_ANT.GND@3 36.2,38.35 FM_ANT.1 33.88,36.86 DAB_ANT.GND@1
  pour Bottom (isolate 0.406): 28.83,46.61 41.27,46.61 41.27,36.2 37.72,36.2 37.72,32.64 18.92,32.64 19.18,38.99 23.75,43.31 28.83,43.31
AMP_MODE  (2 unrouted)
CTS#_LV  (2 unrouted)
GND  (via drill 0.6)  (28 unrouted)
  Top 0.61: LED3.C v9.02,38.48 | MKB_ICSP.3 v66.93,41.53
  Bottom 0.406: T3.2 43.56,21.14 43.56,24 43.56,24.7 T4.2
  Bottom 0.508: R40.2 R59.2
  Bottom 0.61: 12.22,44.5 12.22,45.34 | 12.22,45.34 12.22,45.64 21.21,45.64 | 21.21,45.64 40.26,45.64 | 40.26,45.64 47.88,45.64 | 47.88,45.64 50.42,45.64 UART.3 50.42,41.53 65.66,41.53 | SH1.1 40.26,45.64 | T2.1 12.22,44.5 | 12.22,44.5 12.22,45.34 | T1.1 19.94,40.26 21.21,41.53 21.21,42.29 21.21,45.64 | C27.1 C28.1 | R99.2 T5.2 31.88,20.24 31.88,20.7 30.1,22.48 U$2.31 | 35.18,14.86 U$2.12 35.18,14.86 | 35.18,14.86 R99.2 | R40.2 R99.2 | T3.2 R59.2 | v9.02,38.48 9.02,37.72 | 9.02,37.72 9.02,37.47 arc90 D10.A | C5.2 8.51,39.69 8.51,38.48 9.02,37.97 9.02,37.72 | 65.66,41.53 v66.93,41.53 65.66,41.53 | R8.1 47.88,45.64
  Bottom 0.813: T2.1 9.27,44.5 12V_A_ANT.2 C5.2
  pour Top: -0.38,58.04 -0.38,46.61 78.36,46.61 78.36,58.04
  pour Bottom: -0.38,58.04 -0.38,47.88 78.36,47.88 78.36,58.04
ICSP_MCLR  (2 unrouted)
ICSP_PGC  (1 unrouted)
ICSP_PGD  (1 unrouted)
ICSP_VCC  (5 unrouted)
KBRD_BUT2  (1 unrouted)
KBRD_BUT3  (1 unrouted)
KBRD_BUT4  (1 unrouted)
  Bottom 0.61: U$2.8 25.27,12.06
KBRD_BUT5  (1 unrouted)
  Bottom 0.61: U$2.9 27.81,12.06
KBRD_EQU_DOWN  (1 unrouted)
KBRD_EQU_UP  (1 unrouted)
KBRD_INT  (1 unrouted)
KBRD_VOL_DOWN  (1 unrouted)
KBRD_VOL_UP  (1 unrouted)
MKB_4.8V  (3 unrouted)
MKB_ACTIVE_PWR
  Bottom 0.61: R37.2 U$2.27
MKB_PIC_PGD_PIN
  Bottom 0.61: U$2.28 38.23,28.07 38.23,30.35 40,30.35 R1.2
MKB_PIC_PGD_PIN_  (via drill 0.6)
  Top 0.61: 56.52,41.53 55.75,41.53 | 55.75,41.53 64.39,41.53 MKB_ICSP.4 | 55.75,41.53 53.21,38.99 52.96,38.73 52.96,36.96 52.7,36.7 51.94,36.7 51.94,34.92 51.44,34.42 v47.88,34.42 v41.53,34.42
  Bottom 0.61: R1.1 41.53,34.35 v41.53,34.42 | v47.88,34.42 R8.2
MKB_RX_HV  (via drill 0.6)
  Top 0.61: R10.2 Q4.3 45.59,42.12 v45.59,40.77
  Bottom 0.61: v45.59,40.77 45.59,36.13 45.59,27.81 arc-90 U$2.25
MKB_TX_HV  (via drill 0.6)
  Top 0.61: Q3.3 R7.2 44.58,38.48 v44.32,37.21
  Bottom 0.61: U$2.26 42.8,29.08 44.32,30.86 v44.32,37.21
N$1
  Bottom 0.61: T1.2 12.07,38.61 12.07,36.96 13.59,32.38 13.84,32.13 15.37,32.13 15.37,30.35 16.13,29.08 16.13,27.81 16.13,23.03 R2.2
N$2
  Bottom 0.61: D1.A 17.4,32.89 R3.P$5
  Bottom 0.813: T1.3 14.86,34.92 R3.P$5
N$3
  Bottom 0.61: R3.P$3 22.48,35.69 25.78,38.99 26.29,38.99 28.07,38.99 29.08,38.99 30.61,40.77 31.88,40.77 33.66,39.24 34.42,39.24 35.94,41.02 38.1,40.89 TO_MKB_ANT_POS_1450_1475.1
N$4
  Bottom 0.61: DAB_ANT.P$1 31.88,42.04 30.35,42.04 30.1,42.04 28.07,40.01 23.49,40.01 19.94,36.45 R3.P$4 19.94,36.7 L3.2
N$5
  Bottom 0.813: FM_ANT.2 29.84,36.2 25.53,36.2 R3.P$2
N$6
  Bottom 0.61: T2.3 17.4,44.5 | 17.4,44.5 18.67,44.5 D2.A | R3.P$6 17.4,44.5
N$7
  Bottom 0.61: T2.2 10.03,42.6 10.03,39.5 10.79,37.21 10.79,36.96 12.57,31.11 13.59,31.11 13.59,23.24 13.59,23.05 R4.2
N$8  (1 unrouted)
N$9
  Top 0.61: UART.1 55.5,43.05 54.74,42.29 52.96,40.51 51.94,40.51 51.94,37.65 R6.2 49.64,37.65 Q3.2
N$10
  Top 0.61: Q4.2 R9.2 50.74,41.53 51.69,41.53 52.96,42.8 UART.2
N$12
  Bottom 0.61: L3.1 16.14,36.99 L4.2
N$15
  Bottom 0.61: U$2.13 37.72,8 Q7.2 C27.2
N$16
  Bottom 0.61: U$2.14 40.26,8 Q7.1 C28.2
N$18  (1 unrouted)
N$27
  Bottom 0.61: 45.34,17.14 R56.1 42.56,17.08 T3.1 R59.1
N$28
  Bottom 0.61: T3.3 R58.2
N$29  (1 unrouted)
  Bottom 0.61: R58.1 48.32,18.09 R57.2
N$31  (1 unrouted)
N$36
  Bottom 0.61: R40.1 39.12,23.05 R37.1
  Bottom 0.813: R37.1 40.51,22.8 T4.1
N$37
  Bottom 0.61: T4.3 R39.2
N$38  (1 unrouted)
  Bottom 0.61: R39.1 50.42,21.65 R38.2
N$39  (1 unrouted)
N$40  (1 unrouted)
N$41  (1 unrouted)
N$42  (3 unrouted)
N$68  (6 unrouted)
N$84
  Bottom 0.61: R20-??.1 32.88,22.8 T5.1 R99.1
N$85
  Bottom 0.61: T5.3 R98.2
N$86  (1 unrouted)
  Bottom 0.61: R97.2 4.7,33.15 Q12.B
N$87
  Bottom 0.406: R101.1 R100.1
  Bottom 0.61: R100.1 1.46,38.99 1.65,38.48 3.17,37.72 Q12.C
N$88  (via drill 0.6)
  Top 0.61: v4.45,38.48 LED3.A
  Bottom 0.61: R100.2 v4.45,38.48
N$91
  Bottom 0.61: R101.2 4.19,42.29 4.45,44.07 L2.1 | C5.1 6.29,38.48 7.24,38.48 8,36.96 8,34.67 D10.C
  Bottom 0.813: C5.1 5.65,40.26 R101.2
N$92
  Bottom 0.61: 12V_A_ANT.1 6.67,42.8 L2.2
RI#_LV  (2 unrouted)
RTS#_LV  (2 unrouted)
RXD_TX_LV  (2 unrouted)
SCL  (3 unrouted)
SDA  (3 unrouted)
SWITCH_2_DAB_ANT
  Bottom 0.61: U$2.36 17.4,24.95 R2.1
SWITCH_2_FM_ANT
  Bottom 0.61: U$2.37 R4.1
TO_MKB_VCC  (1 unrouted)
TXD_RX_LH  (2 unrouted)
VDIAG  (2 unrouted)
VM3_ACTIVE_PWR
  Bottom 0.61: U$2.16 R56.2
VM3_CTS#_HV  (2 unrouted)
VM3_RI#_HV  (3 unrouted)
VM3_RTS#_HV  (2 unrouted)
VM3_RXD_TX_HV  (2 unrouted)
VM3_TXD_RX_HV  (2 unrouted)
VMUSIC3_4.8V  (4 unrouted)

### Text on the board
bNames: GND | RXD | TXD | I/O | !SHNT! | !SHDN! | GND